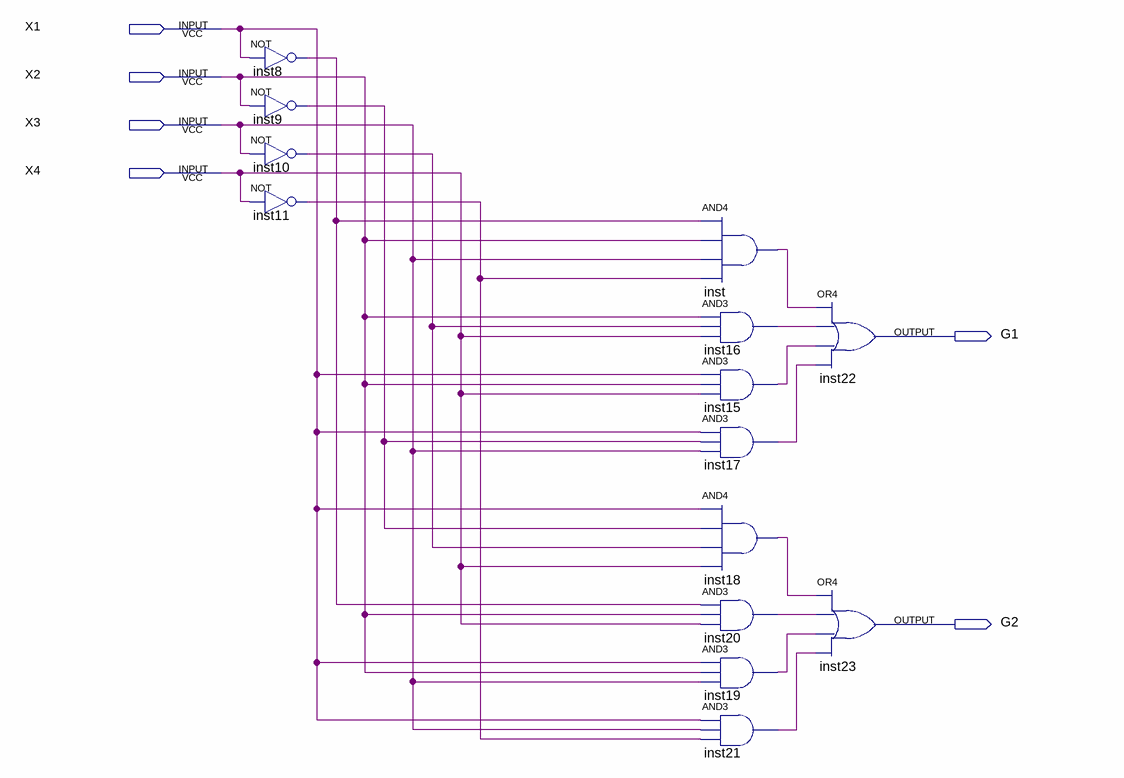
[diagram p0: schematic sheet]
// Quartus schematic LogicaDeResultados.bdf as structural Verilog: 14 symbols, 6 pins
module LogicaDeResultados (
  input  X1,
  input  X2,
  input  X3,
  input  X4,
  output G1,
  output G2
);

  wire inst8_out, inst9_out, inst10_out, inst11_out, inst15_out, inst16_out, inst17_out, inst18_out,
       inst19_out, inst20_out, inst21_out, inst_out;

  not inst8 (inst8_out, X1);
  not inst9 (inst9_out, X2);
  not inst10 (inst10_out, X3);
  not inst11 (inst11_out, X4);
  and inst (inst_out, inst8_out, X2, X3, inst11_out);
  and inst16 (inst16_out, X2, inst10_out, X4);
  and inst15 (inst15_out, X1, X2, X4);
  and inst17 (inst17_out, X1, inst9_out, X3);
  and inst18 (inst18_out, X1, inst9_out, inst10_out, X4);
  and inst20 (inst20_out, inst8_out, X2, X4);
  and inst19 (inst19_out, X1, X2, X3);
  and inst21 (inst21_out, X1, X3, inst11_out);
  or inst22 (G1, inst_out, inst16_out, inst15_out, inst17_out);
  or inst23 (G2, inst18_out, inst20_out, inst19_out, inst21_out);
endmodule
